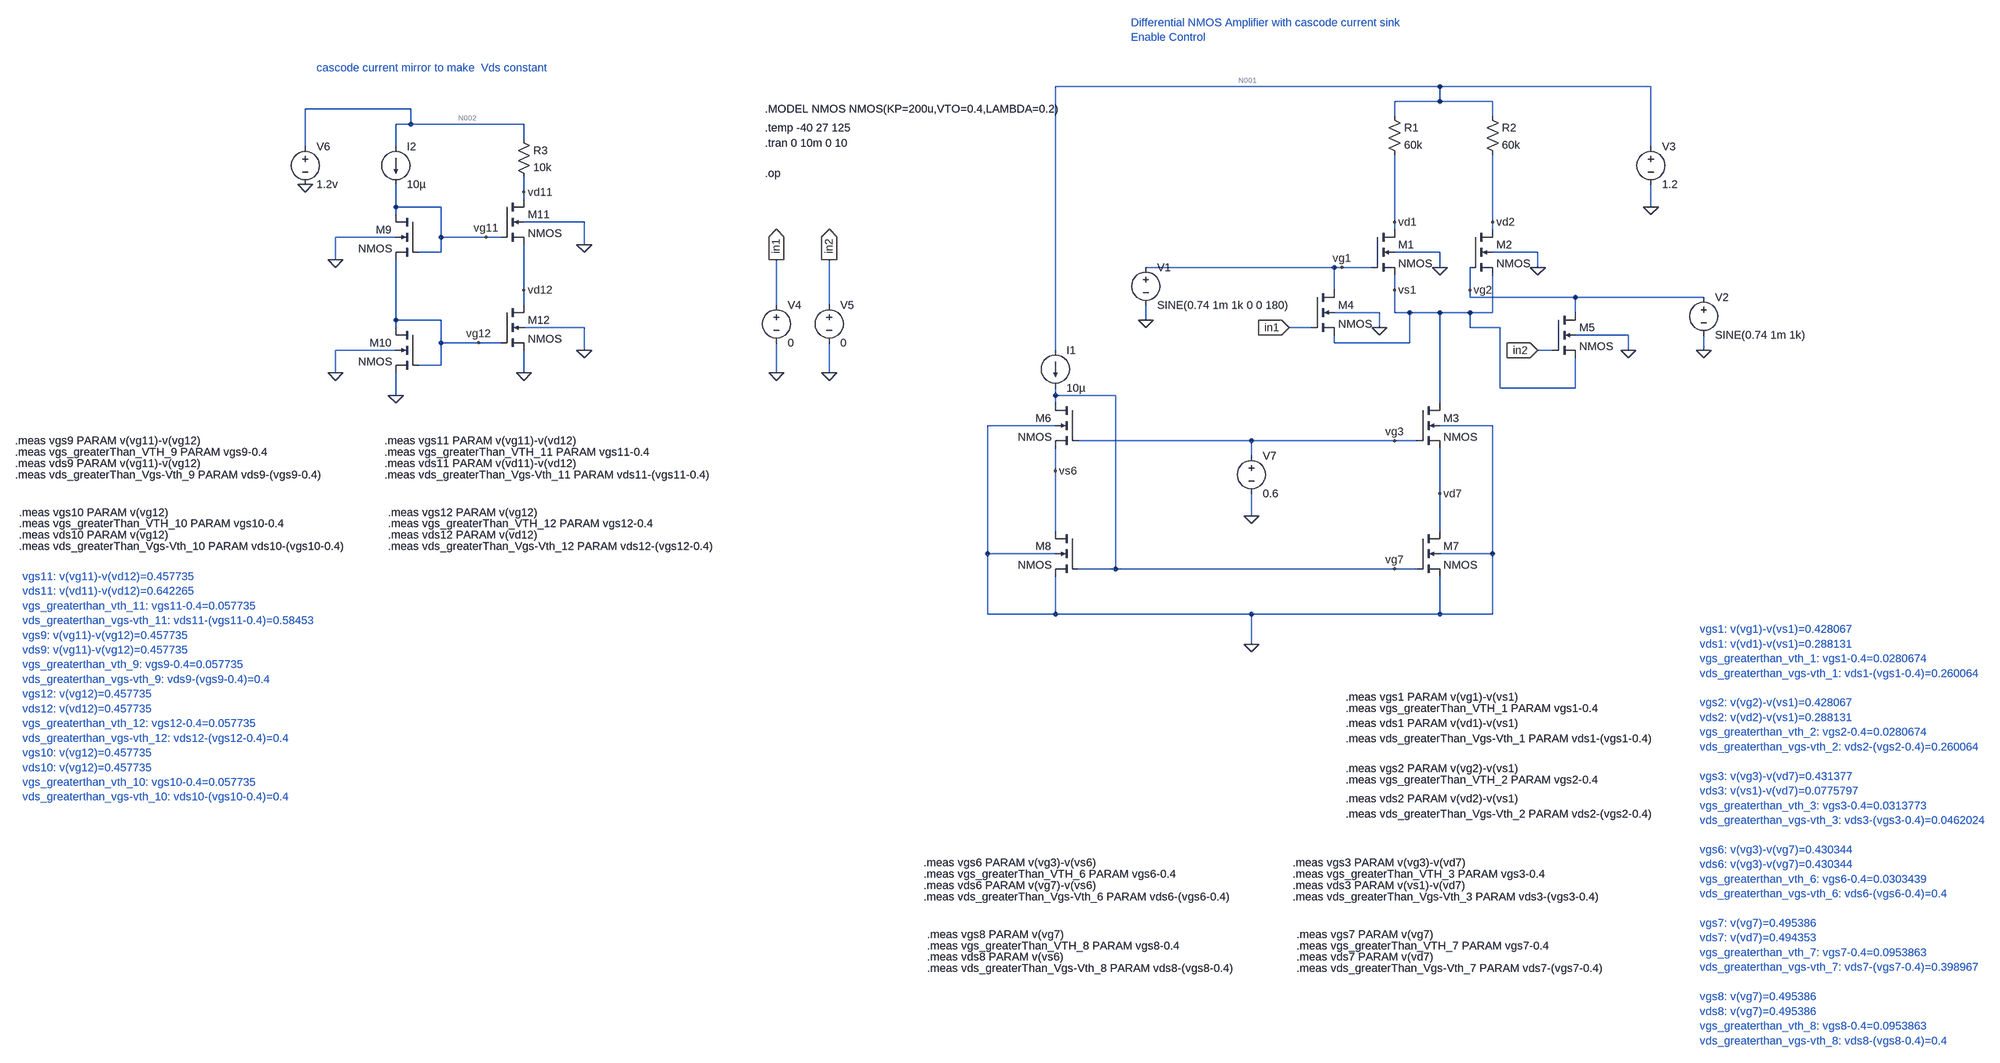
[diagram p0: schematic 6_differential_amplifier_v4_with_cascode_current_mirror_external_supply.asc]
6_differential_amplifier_v4_with_cascode_current_mirror_external_supply.asc, the LTspice schematic file:
Version 4
SHEET 1 2132 1296
WIRE -64 -1216 -880 -1216
WIRE 384 -1216 -64 -1216
WIRE -64 -1184 -64 -1216
WIRE -64 -1184 -160 -1184
WIRE 48 -1184 -64 -1184
WIRE -2448 -1168 -2672 -1168
WIRE -160 -1152 -160 -1184
WIRE 48 -1152 48 -1184
WIRE -2448 -1136 -2448 -1168
WIRE -2448 -1136 -2480 -1136
WIRE -2208 -1136 -2448 -1136
WIRE -2208 -1104 -2208 -1136
WIRE -2672 -1088 -2672 -1168
WIRE -2480 -1088 -2480 -1136
WIRE 384 -1088 384 -1216
WIRE -2208 -992 -2208 -1024
WIRE -2208 -976 -2208 -992
WIRE -2480 -960 -2480 -1008
WIRE -2384 -960 -2480 -960
WIRE 384 -960 384 -1008
WIRE -2480 -944 -2480 -960
WIRE -2080 -928 -2208 -928
WIRE -160 -928 -160 -1072
WIRE 48 -928 48 -1072
WIRE -160 -912 -160 -928
WIRE 48 -912 48 -928
WIRE -2480 -896 -2608 -896
WIRE -2384 -896 -2384 -960
WIRE -2288 -896 -2384 -896
WIRE -2256 -896 -2288 -896
WIRE -2080 -880 -2080 -928
WIRE -2384 -864 -2384 -896
WIRE -2384 -864 -2432 -864
WIRE -64 -864 -160 -864
WIRE 144 -864 48 -864
WIRE -2608 -848 -2608 -896
WIRE -288 -832 -688 -832
WIRE -272 -832 -288 -832
WIRE -208 -832 -272 -832
WIRE -64 -832 -64 -864
WIRE 144 -832 144 -864
WIRE -2208 -784 -2208 -880
WIRE -288 -784 -288 -832
WIRE -160 -784 -160 -816
WIRE 0 -784 0 -832
WIRE 0 -768 0 -784
WIRE 224 -768 0 -768
WIRE 496 -768 224 -768
WIRE -2208 -752 -2208 -784
WIRE -1472 -752 -1472 -848
WIRE -1360 -752 -1360 -848
WIRE -192 -736 -288 -736
WIRE -160 -736 -160 -784
WIRE -128 -736 -160 -736
WIRE -64 -736 -128 -736
WIRE 0 -736 -64 -736
WIRE 48 -736 48 -816
WIRE 48 -736 0 -736
WIRE 224 -736 224 -768
WIRE -2480 -720 -2480 -848
WIRE -2384 -720 -2480 -720
WIRE -688 -720 -688 -752
WIRE -2480 -704 -2480 -720
WIRE -2080 -704 -2208 -704
WIRE -336 -704 -384 -704
WIRE -192 -704 -192 -736
WIRE 0 -704 0 -736
WIRE 64 -704 0 -704
WIRE 336 -688 224 -688
WIRE -2384 -672 -2384 -720
WIRE -2304 -672 -2384 -672
WIRE -2256 -672 -2304 -672
WIRE -288 -672 -288 -688
WIRE -128 -672 -128 -736
WIRE -128 -672 -288 -672
WIRE -2480 -656 -2608 -656
WIRE -2080 -656 -2080 -704
WIRE -880 -656 -880 -1216
WIRE 176 -656 144 -656
WIRE 336 -656 336 -688
WIRE 496 -656 496 -688
WIRE -2384 -624 -2384 -672
WIRE -2384 -624 -2432 -624
WIRE -2608 -608 -2608 -656
WIRE -2208 -608 -2208 -656
WIRE -1472 -608 -1472 -672
WIRE -1360 -608 -1360 -672
WIRE 64 -576 64 -704
WIRE 224 -576 224 -640
WIRE 224 -576 64 -576
WIRE -2480 -560 -2480 -608
WIRE -880 -560 -880 -576
WIRE -752 -560 -880 -560
WIRE -880 -544 -880 -560
WIRE -64 -544 -64 -736
WIRE -880 -496 -1024 -496
WIRE 48 -496 -64 -496
WIRE -464 -464 -832 -464
WIRE -160 -464 -464 -464
WIRE -112 -464 -160 -464
WIRE -464 -432 -464 -464
WIRE -880 -400 -880 -448
WIRE -64 -352 -64 -448
WIRE -464 -304 -464 -352
WIRE -880 -272 -880 -400
WIRE -64 -272 -64 -352
WIRE -1024 -224 -1024 -496
WIRE -880 -224 -1024 -224
WIRE 48 -224 48 -496
WIRE 48 -224 -64 -224
WIRE -752 -192 -752 -560
WIRE -752 -192 -832 -192
WIRE -160 -192 -752 -192
WIRE -112 -192 -160 -192
WIRE -1024 -96 -1024 -224
WIRE -880 -96 -880 -176
WIRE -880 -96 -1024 -96
WIRE -464 -96 -880 -96
WIRE -64 -96 -64 -176
WIRE -64 -96 -464 -96
WIRE 48 -96 48 -224
WIRE 48 -96 -64 -96
WIRE -464 -32 -464 -96
FLAG -688 -720 0
FLAG -64 -832 0
FLAG 144 -832 0
FLAG 496 -656 0
FLAG 384 -960 0
FLAG -272 -832 vg1
FLAG -160 -784 vs1
FLAG -160 -928 vd1
FLAG 0 -784 vg2
FLAG 48 -928 vd2
FLAG -160 -464 vg3
FLAG -1472 -608 0
FLAG -1360 -608 0
FLAG -1472 -848 in1
IOPIN -1472 -848 Out
FLAG -1360 -848 in2
IOPIN -1360 -848 Out
FLAG 336 -656 0
FLAG -192 -704 0
FLAG -384 -704 in1
IOPIN -384 -704 In
FLAG 144 -656 in2
IOPIN 144 -656 In
FLAG -464 -32 0
FLAG -160 -192 vg7
FLAG -64 -352 vd7
FLAG -2608 -848 0
FLAG -2480 -560 0
FLAG -2608 -608 0
FLAG -2080 -880 0
FLAG -2208 -608 0
FLAG -2080 -656 0
FLAG -2672 -1008 0
FLAG -2288 -896 vg11
FLAG -2304 -672 vg12
FLAG -2208 -992 vd11
FLAG -2208 -784 vd12
FLAG -464 -304 0
FLAG -880 -400 vs6
DATAFLAG -880 -368 ""
DATAFLAG -64 -352 ""
DATAFLAG -2480 -800 ""
DATAFLAG -2208 -816 ""
DATAFLAG -64 -656 ""
DATAFLAG -2080 -912 ""
DATAFLAG -288 -192 ""
DATAFLAG -320 -464 ""
DATAFLAG -400 -832 ""
DATAFLAG -160 -1024 ""
SYMBOL nmos4 -208 -912 R0
SYMATTR InstName M1
SYMATTR Value2 l=0.05u w=272u
SYMBOL nmos4 0 -912 R0
SYMATTR InstName M2
SYMATTR Value2 l=0.05u w=272u
SYMBOL nmos4 -112 -544 R0
SYMATTR InstName M3
SYMATTR Value2 l=4u w=40u
SYMBOL voltage -688 -848 R0
WINDOW 123 0 0 Left 0
WINDOW 39 0 0 Left 0
SYMATTR InstName V1
SYMATTR Value SINE(0.74 1m 1k 0 0 180)
SYMBOL voltage 496 -784 R0
WINDOW 123 0 0 Left 0
WINDOW 39 0 0 Left 0
SYMATTR InstName V2
SYMATTR Value SINE(0.74 1m 1k)
SYMBOL voltage 384 -1104 R0
WINDOW 123 0 0 Left 0
WINDOW 39 0 0 Left 0
SYMATTR InstName V3
SYMATTR Value 1.2
SYMBOL res -176 -1168 R0
SYMATTR InstName R1
SYMATTR Value 60k
SYMBOL res 32 -1168 R0
SYMATTR InstName R2
SYMATTR Value 60k
SYMBOL voltage -1472 -768 R0
WINDOW 123 0 0 Left 0
WINDOW 39 0 0 Left 0
SYMATTR InstName V4
SYMATTR Value 0
SYMBOL voltage -1360 -768 R0
WINDOW 123 0 0 Left 0
WINDOW 39 0 0 Left 0
SYMATTR InstName V5
SYMATTR Value 0
SYMBOL nmos4 -336 -784 R0
SYMATTR InstName M4
SYMATTR Value2 l=1u w=100u
SYMBOL nmos4 176 -736 R0
SYMATTR InstName M5
SYMATTR Value2 l=1u w=100u
SYMBOL current -880 -656 R0
WINDOW 123 0 0 Left 0
WINDOW 39 0 0 Left 0
SYMATTR InstName I1
SYMATTR Value 10µ
SYMBOL nmos4 -832 -544 M0
SYMATTR InstName M6
SYMATTR Value2 l=4u w=40u
SYMBOL nmos4 -112 -272 R0
SYMATTR InstName M7
SYMATTR Value2 l=4u w=60u
SYMBOL nmos4 -832 -272 M0
SYMATTR InstName M8
SYMATTR Value2 l=4u w=60u
SYMBOL current -2480 -1088 R0
WINDOW 123 0 0 Left 0
WINDOW 39 0 0 Left 0
SYMATTR InstName I2
SYMATTR Value 10µ
SYMBOL res -2224 -1120 R0
SYMATTR InstName R3
SYMATTR Value 10k
SYMBOL nmos4 -2432 -944 M0
SYMATTR InstName M9
SYMATTR Value2 l=1u w=30u
SYMBOL nmos4 -2432 -704 M0
SYMATTR InstName M10
SYMATTR Value2 l=1u w=30u
SYMBOL nmos4 -2256 -976 R0
SYMATTR InstName M11
SYMATTR Value2 l=1u w=30u
SYMBOL nmos4 -2256 -752 R0
SYMATTR InstName M12
SYMATTR Value2 l=1u w=30u
SYMBOL voltage -2672 -1104 R0
WINDOW 123 0 0 Left 0
WINDOW 39 0 0 Left 0
SYMATTR InstName V6
SYMATTR Value 1.2v
SYMBOL voltage -464 -448 R0
WINDOW 123 0 0 Left 0
WINDOW 39 0 0 Left 0
SYMATTR InstName V7
SYMATTR Value 0.6
TEXT -720 -1352 Left 2 ;Differential NMOS Amplifier with cascode current sink\nEnable Control
TEXT -1496 -1168 Left 2 !.MODEL NMOS NMOS(KP=200u,VTO=0.4,LAMBDA=0.2)
TEXT -1496 -1096 Left 2 !.tran 0 10m 0 10
TEXT -1496 -1032 Left 2 !.op
TEXT -1496 -1128 Left 2 !.temp -40 27 125
TEXT -2648 -1256 Left 2 ;cascode current mirror to make  Vds constant
TEXT -264 80 Left 2 !.meas vgs1 PARAM v(vg1)-v(vs1)
TEXT -264 136 Left 2 !.meas vds1 PARAM v(vd1)-v(vs1)
TEXT -264 104 Left 2 !.meas vgs_greaterThan_VTH_1 PARAM vgs1-0.4
TEXT -264 168 Left 2 !.meas vds_greaterThan_Vgs-Vth_1 PARAM vds1-(vgs1-0.4)
TEXT -264 232 Left 2 !.meas vgs2 PARAM v(vg2)-v(vs1)
TEXT -264 296 Left 2 !.meas vds2 PARAM v(vd2)-v(vs1)
TEXT -264 256 Left 2 !.meas vgs_greaterThan_VTH_2 PARAM vgs2-0.4
TEXT -264 328 Left 2 !.meas vds_greaterThan_Vgs-Vth_2 PARAM vds2-(vgs2-0.4)
TEXT -376 432 Left 2 !.meas vgs3 PARAM v(vg3)-v(vd7)
TEXT -376 480 Left 2 !.meas vds3 PARAM v(vs1)-v(vd7)
TEXT -376 456 Left 2 !.meas vgs_greaterThan_VTH_3 PARAM vgs3-0.4
TEXT -376 504 Left 2 !.meas vds_greaterThan_Vgs-Vth_3 PARAM vds3-(vgs3-0.4)
TEXT -1160 432 Left 2 !.meas vgs6 PARAM v(vg3)-v(vs6)
TEXT -1160 480 Left 2 !.meas vds6 PARAM v(vg7)-v(vs6)
TEXT -1160 456 Left 2 !.meas vgs_greaterThan_VTH_6 PARAM vgs6-0.4
TEXT -1160 504 Left 2 !.meas vds_greaterThan_Vgs-Vth_6 PARAM vds6-(vgs6-0.4)
TEXT -368 584 Left 2 !.meas vgs7 PARAM v(vg7)
TEXT -368 632 Left 2 !.meas vds7 PARAM v(vd7)
TEXT -368 608 Left 2 !.meas vgs_greaterThan_VTH_7 PARAM vgs7-0.4
TEXT -368 656 Left 2 !.meas vds_greaterThan_Vgs-Vth_7 PARAM vds7-(vgs7-0.4)
TEXT -1152 584 Left 2 !.meas vgs8 PARAM v(vg7)
TEXT -1152 632 Left 2 !.meas vds8 PARAM v(vs6)
TEXT -1152 608 Left 2 !.meas vgs_greaterThan_VTH_8 PARAM vgs8-0.4
TEXT -1152 656 Left 2 !.meas vds_greaterThan_Vgs-Vth_8 PARAM vds8-(vgs8-0.4)
TEXT -2504 -464 Left 2 !.meas vgs11 PARAM v(vg11)-v(vd12)
TEXT -2504 -416 Left 2 !.meas vds11 PARAM v(vd11)-v(vd12)
TEXT -2504 -440 Left 2 !.meas vgs_greaterThan_VTH_11 PARAM vgs11-0.4
TEXT -2504 -392 Left 2 !.meas vds_greaterThan_Vgs-Vth_11 PARAM vds11-(vgs11-0.4)
TEXT -3288 -464 Left 2 !.meas vgs9 PARAM v(vg11)-v(vg12)
TEXT -3288 -416 Left 2 !.meas vds9 PARAM v(vg11)-v(vg12)
TEXT -3288 -440 Left 2 !.meas vgs_greaterThan_VTH_9 PARAM vgs9-0.4
TEXT -3288 -392 Left 2 !.meas vds_greaterThan_Vgs-Vth_9 PARAM vds9-(vgs9-0.4)
TEXT -2496 -312 Left 2 !.meas vgs12 PARAM v(vg12)
TEXT -2496 -264 Left 2 !.meas vds12 PARAM v(vd12)
TEXT -2496 -288 Left 2 !.meas vgs_greaterThan_VTH_12 PARAM vgs12-0.4
TEXT -2496 -240 Left 2 !.meas vds_greaterThan_Vgs-Vth_12 PARAM vds12-(vgs12-0.4)
TEXT -3280 -312 Left 2 !.meas vgs10 PARAM v(vg12)
TEXT -3280 -264 Left 2 !.meas vds10 PARAM v(vg12)
TEXT -3280 -288 Left 2 !.meas vgs_greaterThan_VTH_10 PARAM vgs10-0.4
TEXT -3280 -240 Left 2 !.meas vds_greaterThan_Vgs-Vth_10 PARAM vds10-(vgs10-0.4)
TEXT -3272 -176 Left 2 ;vgs11: v(vg11)-v(vd12)=0.457735\nvds11: v(vd11)-v(vd12)=0.642265\nvgs_greaterthan_vth_11: vgs11-0.4=0.057735\nvds_greaterthan_vgs-vth_11: vds11-(vgs11-0.4)=0.58453\nvgs9: v(vg11)-v(vg12)=0.457735\nvds9: v(vg11)-v(vg12)=0.457735\nvgs_greaterthan_vth_9: vgs9-0.4=0.057735\nvds_greaterthan_vgs-vth_9: vds9-(vgs9-0.4)=0.4\nvgs12: v(vg12)=0.457735\nvds12: v(vd12)=0.457735\nvgs_greaterthan_vth_12: vgs12-0.4=0.057735\nvds_greaterthan_vgs-vth_12: vds12-(vgs12-0.4)=0.4\nvgs10: v(vg12)=0.457735\nvds10: v(vg12)=0.457735\nvgs_greaterthan_vth_10: vgs10-0.4=0.057735\nvds_greaterthan_vgs-vth_10: vds10-(vgs10-0.4)=0.4
TEXT 488 -64 Left 2 ;vgs1: v(vg1)-v(vs1)=0.428067\nvds1: v(vd1)-v(vs1)=0.288131\nvgs_greaterthan_vth_1: vgs1-0.4=0.0280674\nvds_greaterthan_vgs-vth_1: vds1-(vgs1-0.4)=0.260064\n \nvgs2: v(vg2)-v(vs1)=0.428067\nvds2: v(vd2)-v(vs1)=0.288131\nvgs_greaterthan_vth_2: vgs2-0.4=0.0280674\nvds_greaterthan_vgs-vth_2: vds2-(vgs2-0.4)=0.260064\n \nvgs3: v(vg3)-v(vd7)=0.431377\nvds3: v(vs1)-v(vd7)=0.0775797\nvgs_greaterthan_vth_3: vgs3-0.4=0.0313773\nvds_greaterthan_vgs-vth_3: vds3-(vgs3-0.4)=0.0462024\n \nvgs6: v(vg3)-v(vg7)=0.430344\nvds6: v(vg3)-v(vg7)=0.430344\nvgs_greaterthan_vth_6: vgs6-0.4=0.0303439\nvds_greaterthan_vgs-vth_6: vds6-(vgs6-0.4)=0.4\n \nvgs7: v(vg7)=0.495386\nvds7: v(vd7)=0.494353\nvgs_greaterthan_vth_7: vgs7-0.4=0.0953863\nvds_greaterthan_vgs-vth_7: vds7-(vgs7-0.4)=0.398967\n \nvgs8: v(vg7)=0.495386\nvds8: v(vg7)=0.495386\nvgs_greaterthan_vth_8: vgs8-0.4=0.0953863\nvds_greaterthan_vgs-vth_8: vds8-(vgs8-0.4)=0.4

The netlist it stands for:
* 6_differential_amplifier_v4_with_cascode_current_mirror_external_supply.asc
M1 vd1 vg1 vs1 0 NMOS l=0.05u w=272u
M2 vd2 vg2 vs1 0 NMOS l=0.05u w=272u
M3 vs1 vg3 vd7 0 NMOS l=4u w=40u
V1 vg1 0 SINE(0.74 1m 1k 0 0 180)
V2 vg2 0 SINE(0.74 1m 1k)
V3 N001 0 1.2
R1 N001 vd1 60k
R2 N001 vd2 60k
V4 in1 0 0
V5 in2 0 0
M4 vg1 in1 vs1 0 NMOS l=1u w=100u
M5 vg2 in2 vs1 0 NMOS l=1u w=100u
I1 N001 vg7 10µ
M6 vg7 vg3 vs6 0 NMOS l=4u w=40u
M7 vd7 vg7 0 0 NMOS l=4u w=60u
M8 vs6 vg7 0 0 NMOS l=4u w=60u
I2 N002 vg11 10µ
R3 N002 vd11 10k
M9 vg11 vg11 vg12 0 NMOS l=1u w=30u
M10 vg12 vg12 0 0 NMOS l=1u w=30u
M11 vd11 vg11 vd12 0 NMOS l=1u w=30u
M12 vd12 vg12 0 0 NMOS l=1u w=30u
V6 N002 0 1.2v
V7 vg3 0 0.6
.model NMOS NMOS
.model PMOS PMOS
.lib standard.mos
* Differential NMOS Amplifier with cascode current sink
* Enable Control
.MODEL NMOS NMOS(KP=200u,VTO=0.4,LAMBDA=0.2)
.tran 0 10m 0 10
.op
.temp -40 27 125
* cascode current mirror to make  Vds constant
.meas vgs1 PARAM v(vg1)-v(vs1)
.meas vds1 PARAM v(vd1)-v(vs1)
.meas vgs_greaterThan_VTH_1 PARAM vgs1-0.4
.meas vds_greaterThan_Vgs-Vth_1 PARAM vds1-(vgs1-0.4)
.meas vgs2 PARAM v(vg2)-v(vs1)
.meas vds2 PARAM v(vd2)-v(vs1)
.meas vgs_greaterThan_VTH_2 PARAM vgs2-0.4
.meas vds_greaterThan_Vgs-Vth_2 PARAM vds2-(vgs2-0.4)
.meas vgs3 PARAM v(vg3)-v(vd7)
.meas vds3 PARAM v(vs1)-v(vd7)
.meas vgs_greaterThan_VTH_3 PARAM vgs3-0.4
.meas vds_greaterThan_Vgs-Vth_3 PARAM vds3-(vgs3-0.4)
.meas vgs6 PARAM v(vg3)-v(vs6)
.meas vds6 PARAM v(vg7)-v(vs6)
.meas vgs_greaterThan_VTH_6 PARAM vgs6-0.4
.meas vds_greaterThan_Vgs-Vth_6 PARAM vds6-(vgs6-0.4)
.meas vgs7 PARAM v(vg7)
.meas vds7 PARAM v(vd7)
.meas vgs_greaterThan_VTH_7 PARAM vgs7-0.4
.meas vds_greaterThan_Vgs-Vth_7 PARAM vds7-(vgs7-0.4)
.meas vgs8 PARAM v(vg7)
.meas vds8 PARAM v(vs6)
.meas vgs_greaterThan_VTH_8 PARAM vgs8-0.4
.meas vds_greaterThan_Vgs-Vth_8 PARAM vds8-(vgs8-0.4)
.meas vgs11 PARAM v(vg11)-v(vd12)
.meas vds11 PARAM v(vd11)-v(vd12)
.meas vgs_greaterThan_VTH_11 PARAM vgs11-0.4
.meas vds_greaterThan_Vgs-Vth_11 PARAM vds11-(vgs11-0.4)
.meas vgs9 PARAM v(vg11)-v(vg12)
.meas vds9 PARAM v(vg11)-v(vg12)
.meas vgs_greaterThan_VTH_9 PARAM vgs9-0.4
.meas vds_greaterThan_Vgs-Vth_9 PARAM vds9-(vgs9-0.4)
.meas vgs12 PARAM v(vg12)
.meas vds12 PARAM v(vd12)
.meas vgs_greaterThan_VTH_12 PARAM vgs12-0.4
.meas vds_greaterThan_Vgs-Vth_12 PARAM vds12-(vgs12-0.4)
.meas vgs10 PARAM v(vg12)
.meas vds10 PARAM v(vg12)
.meas vgs_greaterThan_VTH_10 PARAM vgs10-0.4
.meas vds_greaterThan_Vgs-Vth_10 PARAM vds10-(vgs10-0.4)
* vgs11: v(vg11)-v(vd12)=0.457735
* vds11: v(vd11)-v(vd12)=0.642265
* vgs_greaterthan_vth_11: vgs11-0.4=0.057735
* vds_greaterthan_vgs-vth_11: vds11-(vgs11-0.4)=0.58453
* vgs9: v(vg11)-v(vg12)=0.457735
* vds9: v(vg11)-v(vg12)=0.457735
* vgs_greaterthan_vth_9: vgs9-0.4=0.057735
* vds_greaterthan_vgs-vth_9: vds9-(vgs9-0.4)=0.4
* vgs12: v(vg12)=0.457735
* vds12: v(vd12)=0.457735
* vgs_greaterthan_vth_12: vgs12-0.4=0.057735
* vds_greaterthan_vgs-vth_12: vds12-(vgs12-0.4)=0.4
* vgs10: v(vg12)=0.457735
* vds10: v(vg12)=0.457735
* vgs_greaterthan_vth_10: vgs10-0.4=0.057735
* vds_greaterthan_vgs-vth_10: vds10-(vgs10-0.4)=0.4
* vgs1: v(vg1)-v(vs1)=0.428067
* vds1: v(vd1)-v(vs1)=0.288131
* vgs_greaterthan_vth_1: vgs1-0.4=0.0280674
* vds_greaterthan_vgs-vth_1: vds1-(vgs1-0.4)=0.260064
* vgs2: v(vg2)-v(vs1)=0.428067
* vds2: v(vd2)-v(vs1)=0.288131
* vgs_greaterthan_vth_2: vgs2-0.4=0.0280674
* vds_greaterthan_vgs-vth_2: vds2-(vgs2-0.4)=0.260064
* vgs3: v(vg3)-v(vd7)=0.431377
* vds3: v(vs1)-v(vd7)=0.0775797
* vgs_greaterthan_vth_3: vgs3-0.4=0.0313773
* vds_greaterthan_vgs-vth_3: vds3-(vgs3-0.4)=0.0462024
* vgs6: v(vg3)-v(vg7)=0.430344
* vds6: v(vg3)-v(vg7)=0.430344
* vgs_greaterthan_vth_6: vgs6-0.4=0.0303439
* vds_greaterthan_vgs-vth_6: vds6-(vgs6-0.4)=0.4
* vgs7: v(vg7)=0.495386
* vds7: v(vd7)=0.494353
* vgs_greaterthan_vth_7: vgs7-0.4=0.0953863
* vds_greaterthan_vgs-vth_7: vds7-(vgs7-0.4)=0.398967
* vgs8: v(vg7)=0.495386
* vds8: v(vg7)=0.495386
* vgs_greaterthan_vth_8: vgs8-0.4=0.0953863
* vds_greaterthan_vgs-vth_8: vds8-(vgs8-0.4)=0.4
.backanno
.end

* Results of the author's LTspice run, read from the files saved beside the schematic
* Operating Point (first step), zero values left out:
*   temperature = -40 
*   V(vd1) = 902.8 mV
*   V(vg1) = 740 mV
*   V(vs1) = 272.5 mV
*   V(vd2) = 902.8 mV
*   V(vg2) = 740 mV
*   V(vg3) = 600 mV
*   V(vd7) = 54.29 mV
*   V(n001) = 1.2 V
*   V(vg7) = 533.4 mV
*   V(vs6) = 55.85 mV
*   V(n002) = 1.2 V
*   V(vg11) = 1.021 V
*   V(vd11) = 1.1 V
*   V(vg12) = 510.6 mV
*   V(vd12) = 510.9 mV
*   Id(M12) = 10 µA
*   Is(M12) = -10 µA
*   Id(M11) = 10 µA
*   Ib(M11) = -1.611 pA
*   Is(M11) = -10 µA
*   Id(M10) = 10 µA
*   Is(M10) = -10 µA
*   Id(M9) = 10 µA
*   Ib(M9) = -1.532 pA
*   Is(M9) = -10 µA
*   Id(M8) = 10 µA
*   Is(M8) = -10 µA
*   Id(M7) = 9.905 µA
*   Is(M7) = -9.905 µA
*   Id(M6) = 10 µA
*   Is(M6) = -10 µA
*   Id(M5) = 1.207 pA
*   Ib(M5) = -1.013 pA
*   Id(M4) = 1.207 pA
*   Ib(M4) = -1.013 pA
*   Id(M3) = 9.905 µA
*   Is(M3) = -9.905 µA
*   Id(M2) = 4.953 µA
*   Ib(M2) = -1.175 pA
*   Is(M2) = -4.953 µA
*   Id(M1) = 4.953 µA
*   Ib(M1) = -1.175 pA
*   Is(M1) = -4.953 µA
*   I(I2) = 10 µA
*   I(I1) = 10 µA
*   I(R3) = 10 µA
*   I(R2) = 4.953 µA
*   I(R1) = 4.953 µA
*   I(V6) = -20 µA
*   I(V3) = -19.91 µA
*   I(V2) = -1.207 pA
*   I(V1) = -1.207 pA
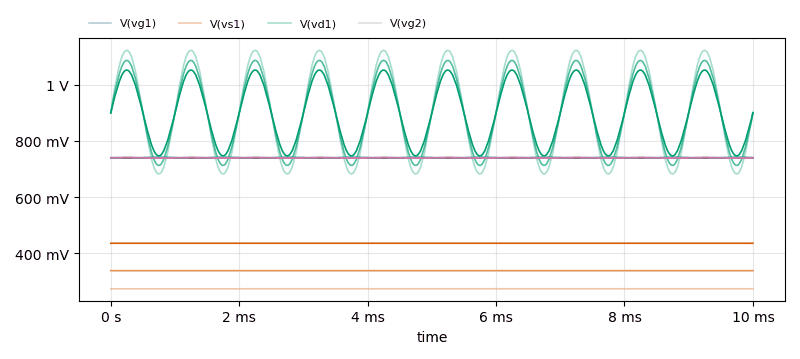
[diagram p1: Transient Analysis of 6_differential_amplifier_v4_with_cascode_current_mirror_external_supply.asc, plotted from the saved traces]
* Transient Analysis, 3 runs:
*   V(vg1) [temp=-40°C]: min 739 mV, max 741 mV, average 740 mV, rms 740 mV, last 740 mV
*   V(vg1) [temp=27°C]: min 739 mV, max 741 mV, average 740 mV, rms 740 mV, last 740 mV
*   V(vg1) [temp=125°C]: min 739 mV, max 741 mV, average 740 mV, rms 740 mV, last 740 mV
*   V(vs1) [temp=-40°C]: min 272.5 mV, max 272.7 mV, average 272.6 mV, rms 272.6 mV, last 272.5 mV
*   V(vs1) [temp=27°C]: min 337.1 mV, max 337.3 mV, average 337.2 mV, rms 337.2 mV, last 337.1 mV
*   V(vs1) [temp=125°C]: min 435 mV, max 435.2 mV, average 435.1 mV, rms 435.1 mV, last 435 mV
*   V(vd1) [temp=-40°C]: min 682.5 mV, max 1.123 V, average 902.8 mV, rms 916.7 mV, last 902.9 mV
*   V(vd1) [temp=27°C]: min 712.8 mV, max 1.087 V, average 900.1 mV, rms 910 mV, last 900.1 mV
*   V(vd1) [temp=125°C]: min 746.7 mV, max 1.053 V, average 899.8 mV, rms 906.4 mV, last 899.8 mV
*   V(vg2) [temp=-40°C]: min 739 mV, max 741 mV, average 740 mV, rms 740 mV, last 740 mV
*   V(vg2) [temp=27°C]: min 739 mV, max 741 mV, average 740 mV, rms 740 mV, last 740 mV
*   V(vg2) [temp=125°C]: min 739 mV, max 741 mV, average 740 mV, rms 740 mV, last 740 mV
* From the log:
*   Measurement: vgs1
*     step  v(vg1)-v(vs1)
*        1  0.467455
*        2  0.402874
*        3  0.304955
*   Measurement: vds1
*     step  v(vd1)-v(vs1)
*        1  0.630325
*        2  0.562968
*        3  0.464772
*   Measurement: vgs_greaterthan_vth_1
*     step  vgs1-0.4
*        1  0.0674549
*        2  0.00287393
*        3  -0.0950449
*   Measurement: vds_greaterthan_vgs-vth_1
*     step  vds1-(vgs1-0.4)
*        1  0.56287
*        2  0.560094
*        3  0.559817
*   Measurement: vgs2
*     step  v(vg2)-v(vs1)
*        1  0.467455
*        2  0.402874
*        3  0.304955
*   Measurement: vds2
*     step  v(vd2)-v(vs1)
*        1  0.630258
*        2  0.562931
*        3  0.464753
*   Measurement: vgs_greaterthan_vth_2
*     step  vgs2-0.4
*        1  0.0674549
*        2  0.00287393
*        3  -0.0950449
*   Measurement: vds_greaterthan_vgs-vth_2
*     step  vds2-(vgs2-0.4)
*        1  0.562803
*        2  0.560057
*        3  0.559798
*   Measurement: vgs3
*     step  v(vg3)-v(vd7)
*        1  0.545711
*        2  0.497719
*        3  0.421914
*   Measurement: vds3
*     step  v(vs1)-v(vd7)
*        1  0.218256
*        2  0.234845
*        3  0.256958
*   Measurement: vgs_greaterthan_vth_3
*     step  vgs3-0.4
*        1  0.145711
*        2  0.0977188
*        3  0.0219136
*   Measurement: vds_greaterthan_vgs-vth_3
*     step  vds3-(vgs3-0.4)
*        1  0.0725451
*        2  0.137126
*        3  0.235045
*   Measurement: vgs6
*     step  v(vg3)-v(vs6)
*        1  0.544154
*        2  0.496428
*        3  0.422302
*   Measurement: vds6
*     step  v(vg7)-v(vs6)
*        1  0.477591
*        2  0.377245
*        3  0.222833
*   Measurement: vgs_greaterthan_vth_6
*     step  vgs6-0.4
*        1  0.144154
*        2  0.0964284
*        3  0.0223022
*   Measurement: vds_greaterthan_vgs-vth_6
*     step  vds6-(vgs6-0.4)
*        1  0.333437
*        2  0.280817
*        3  0.200531
*   Measurement: vgs7
*     step  v(vg7)
*        1  0.533437
*        2  0.480817
*        3  0.400531
*   Measurement: vds7
*     step  v(vd7)
*        1  0.0542893
*        2  0.102281
*        3  0.178086
*   Measurement: vgs_greaterthan_vth_7
*     step  vgs7-0.4
*        1  0.133437
*        2  0.0808169
*        3  0.000530845
*   Measurement: vds_greaterthan_vgs-vth_7
*     step  vds7-(vgs7-0.4)
*        1  -0.0791475
*        2  0.0214643
*        3  0.177556
*   Measurement: vgs8
*     step  v(vg7)
*        1  0.533437
*        2  0.480817
*        3  0.400531
*   Measurement: vds8
*     step  v(vs6)
*        1  0.055846
*        2  0.103572
*        3  0.177698
*   Measurement: vgs_greaterthan_vth_8
*     step  vgs8-0.4
*        1  0.133437
*        2  0.0808169
*        3  0.000530845
*   Measurement: vds_greaterthan_vgs-vth_8
*     step  vds8-(vgs8-0.4)
*        1  -0.0775909
*        2  0.0227547
*        3  0.177167
*   Measurement: vgs11
*     step  v(vg11)-v(vd12)
*        1  0.510287
*        2  0.454347
*        3  0.368056
*   Measurement: vds11
*     step  v(vd11)-v(vd12)
*        1  0.589069
*        2  0.643783
*        3  0.727572
*   Measurement: vgs_greaterthan_vth_11
*     step  vgs11-0.4
*        1  0.110287
*        2  0.0543471
*        3  -0.0319437
*   Measurement: vds_greaterthan_vgs-vth_11
*     step  vds11-(vgs11-0.4)
*        1  0.478783
*        2  0.589436
*        3  0.759515
*   Measurement: vgs9
*     step  v(vg11)-v(vg12)
*        1  0.510606
*        2  0.455273
*        3  0.370225
*   Measurement: vds9
*     step  v(vg11)-v(vg12)
*        1  0.510606
*        2  0.455273
*        3  0.370225
*   Measurement: vgs_greaterthan_vth_9
*     step  vgs9-0.4
*        1  0.110606
*        2  0.0552734
*        3  -0.0297746
*   Measurement: vds_greaterthan_vgs-vth_9
*     step  vds9-(vgs9-0.4)
*        1  0.4
*        2  0.4
*        3  0.4
*   Measurement: vgs12
*     step  v(vg12)
*        1  0.510606
*        2  0.455273
*        3  0.370219
*   Measurement: vds12
*     step  v(vd12)
*        1  0.510925
*        2  0.4562
*        3  0.372388
*   Measurement: vgs_greaterthan_vth_12
*     step  vgs12-0.4
*        1  0.110606
*        2  0.0552734
*        3  -0.0297811
*   Measurement: vds_greaterthan_vgs-vth_12
*     step  vds12-(vgs12-0.4)
*        1  0.400319
*        2  0.400926
*        3  0.402169
*   Measurement: vgs10
*     step  v(vg12)
*        1  0.510606
*        2  0.455273
*        3  0.370219
*   Measurement: vds10
*     step  v(vg12)
*        1  0.510606
*        2  0.455273
*        3  0.370219
*   Measurement: vgs_greaterthan_vth_10
*     step  vgs10-0.4
*        1  0.110606
*        2  0.0552734
*        3  -0.0297811
*   Measurement: vds_greaterthan_vgs-vth_10
*     step  vds10-(vgs10-0.4)
*        1  0.4
*        2  0.4
*        3  0.4